# EAGLE design PIC Board (EAGLE 5.12)
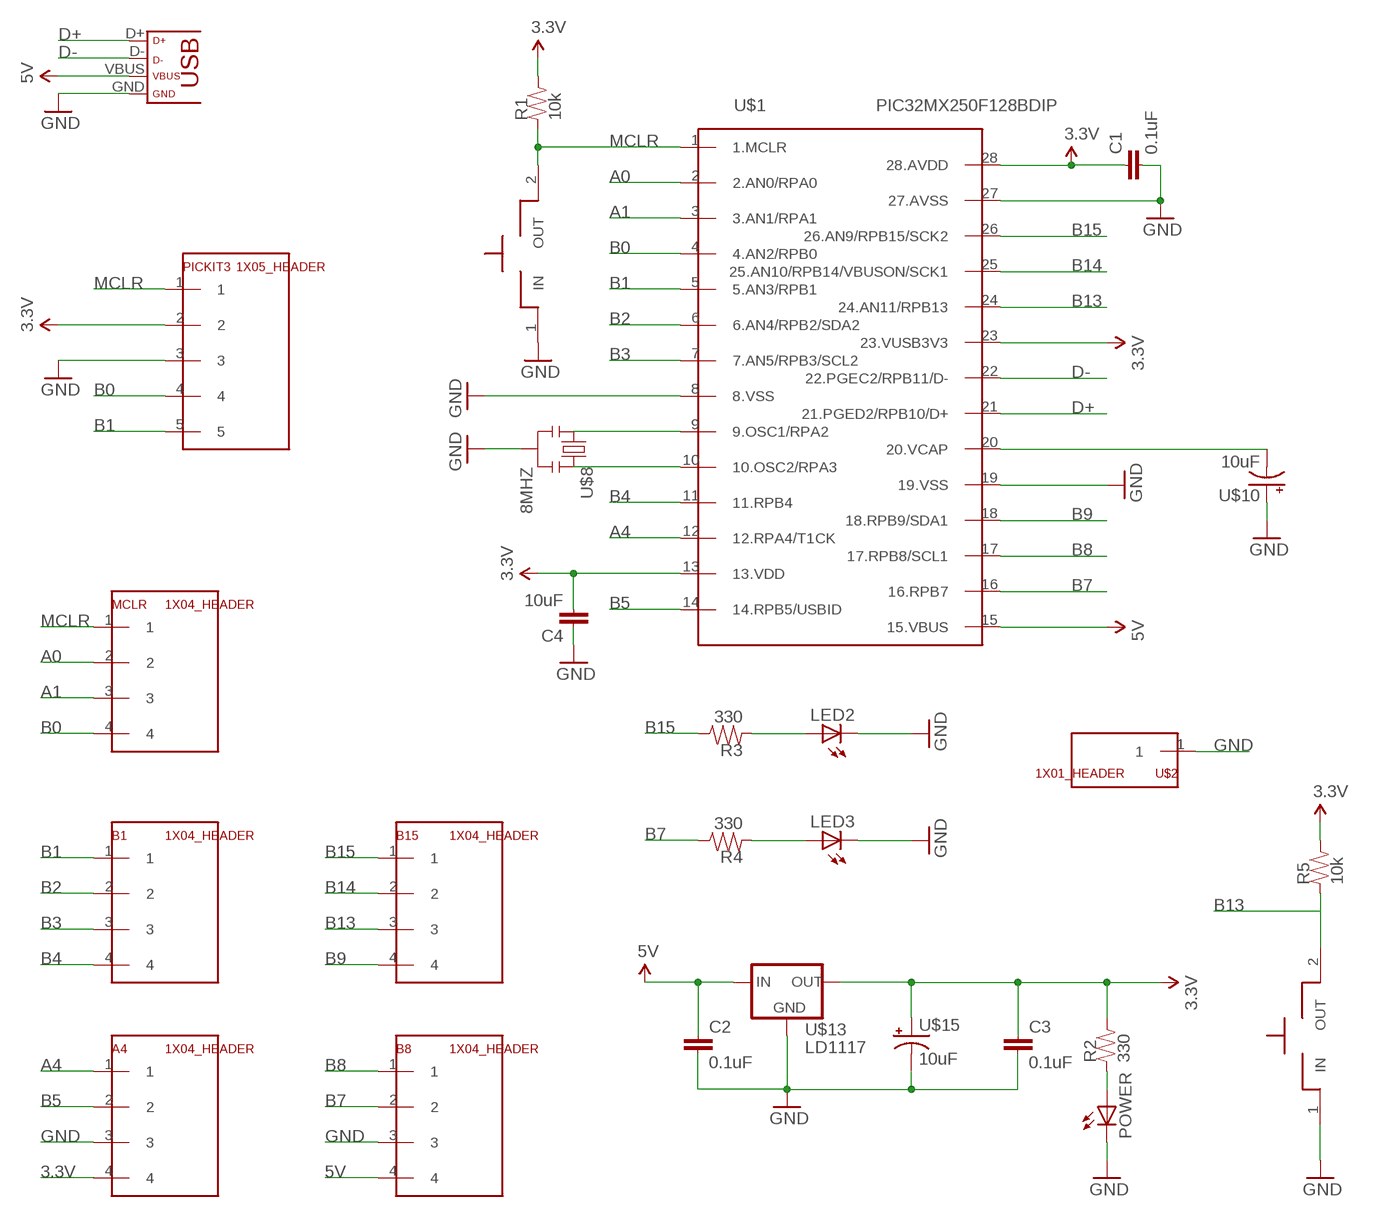
[diagram p0: schematic, sheet 1]

## Parts
A4  1X04_HEADER  [1X04]
B1  1X04_HEADER  [1X04]
B8  1X04_HEADER  [1X04]
B15  1X04_HEADER  [1X04]
C1  0.1uF  CAPPTH  [CAP-PTH-SMALL]
C2  0.1uF  CAPPTH  [CAP-PTH-SMALL]
C3  0.1uF  CAPPTH  [CAP-PTH-SMALL]
C4  10uF  CAPPTH  [CAP-PTH-SMALL]
LED2  LED3MM  [LED3MM]
LED3  LED3MM  [LED3MM]
MCLR  1X04_HEADER  [1X04]
PICKIT3  1X05_HEADER  [1X05]
POWER  LED3MM  [LED3MM]
R1  10k  RRESISTOR(1/4W)  [0207/10]
R2  330  RRESISTOR(1/4W)  [0207/10]
R3  330  RRESISTOR(1/4W)  [0207/10]
R4  330  RRESISTOR(1/4W)  [0207/10]
R5  10k  RRESISTOR(1/4W)  [0207/10]
RESET  BUTTON  [TACTILE_SWITCH]
U$1  PIC32MX250F128BDIP  [DIL28-3]
U$2  1X01_HEADER  [1X01]
U$8  8MHZ  [RESONATOR-PTH]
U$10  10uF  CAP_POL  [CAP_POL_D]
U$11  USB  [USB-MINIB]
U$13  LD1117  [TO220]
U$15  10uF  CAP_POL  [CAP_POL_D]
USER  BUTTON  [TACTILE_SWITCH]

## Nets
3.3V: A4.4 C1.1 C3.1 C4.2 PICKIT3.2 R1.2 R2.2 R5.2 U$1.13(13.VDD) U$1.23(23.VUSB3V3) U$1.28(28.AVDD) U$13.2(OUT) U$15.1(+)
5V: B8.4 C2.1 U$1.15(15.VBUS) U$11.VBUS U$13.3(IN)
A0: MCLR.2 U$1.2(2.AN0/RPA0)
A1: MCLR.3 U$1.3(3.AN1/RPA1)
A4: A4.1 U$1.12(12.RPA4/T1CK)
B0: MCLR.4 PICKIT3.4 U$1.4(4.AN2/RPB0)
B1: B1.1 PICKIT3.5 U$1.5(5.AN3/RPB1)
B2: B1.2 U$1.6(6.AN4/RPB2/SDA2)
B3: B1.3 U$1.7(7.AN5/RPB3/SCL2)
B4: B1.4 U$1.11(11.RPB4)
B5: A4.2 U$1.14(14.RPB5/USBID)
B7: B8.2 R4.2 U$1.16(16.RPB7)
B8: B8.1 U$1.17(17.RPB8/SCL1)
B9: B15.4 U$1.18(18.RPB9/SDA1)
B13: B15.3 R5.1 U$1.24(24.AN11/RPB13) USER.2(OUT)
B14: B15.2 U$1.25(25.AN10/RPB14/VBUSON/SCK1)
B15: B15.1 R3.2 U$1.26(26.AN9/RPB15/SCK2)
D+: U$1.21(21.PGED2/RPB10/D+) U$11.D+
D-: U$1.22(22.PGEC2/RPB11/D-) U$11.D-
GND: A4.3 B8.3 C1.2 C2.2 C3.2 C4.1 LED2.K(C) LED3.K(C) PICKIT3.3 POWER.K(C) RESET.1(IN) U$1.8(8.VSS) U$1.19(19.VSS) U$1.27(27.AVSS) U$2.1 U$8.2 U$10.1(+) U$11.GND U$13.1(GND) U$15.2(-) USER.1(IN)
MCLR: MCLR.1 PICKIT3.1 R1.1 RESET.2(OUT) U$1.1(1.MCLR)
N$1: LED2.A R3.1
N$2: LED3.A R4.1
N$3: POWER.A R2.1
N$23: U$1.20(20.VCAP) U$10.2(-)
OSC1: U$1.9(9.OSC1/RPA2) U$8.1
OSC2: U$1.10(10.OSC2/RPA3) U$8.3

## Library data of the parts
A4 B1 B8 B15 MCLR = ME433:1X04_HEADER
C1-C4 = ME433:CAP: Capacitor Standard 0603 ceramic capacitor, and 0.1" leaded capacitor.
LED2 LED3 POWER = ME433:LED: LEDs Standard schematic elements and footprints for 5mm, 3mm, 1206, and 0603 sized LEDs. 5mm - Spark Fun Electronics SKU : COM-00529 (and others)
PICKIT3 = ME433:1X05_HEADER
R1-R5 = ME433:R: RESISTOR, American symbol
RESET USER = ME433:BUTTON
U$1 = ME433:PIC32MX250F128B
U$2 = ME433:1X01_HEADER
U$8 = ME433:8MHZ
U$10 U$15 = ME433:CAP_POL
U$11 = ME433:USB
U$13 = ME433:LD1117

## Board
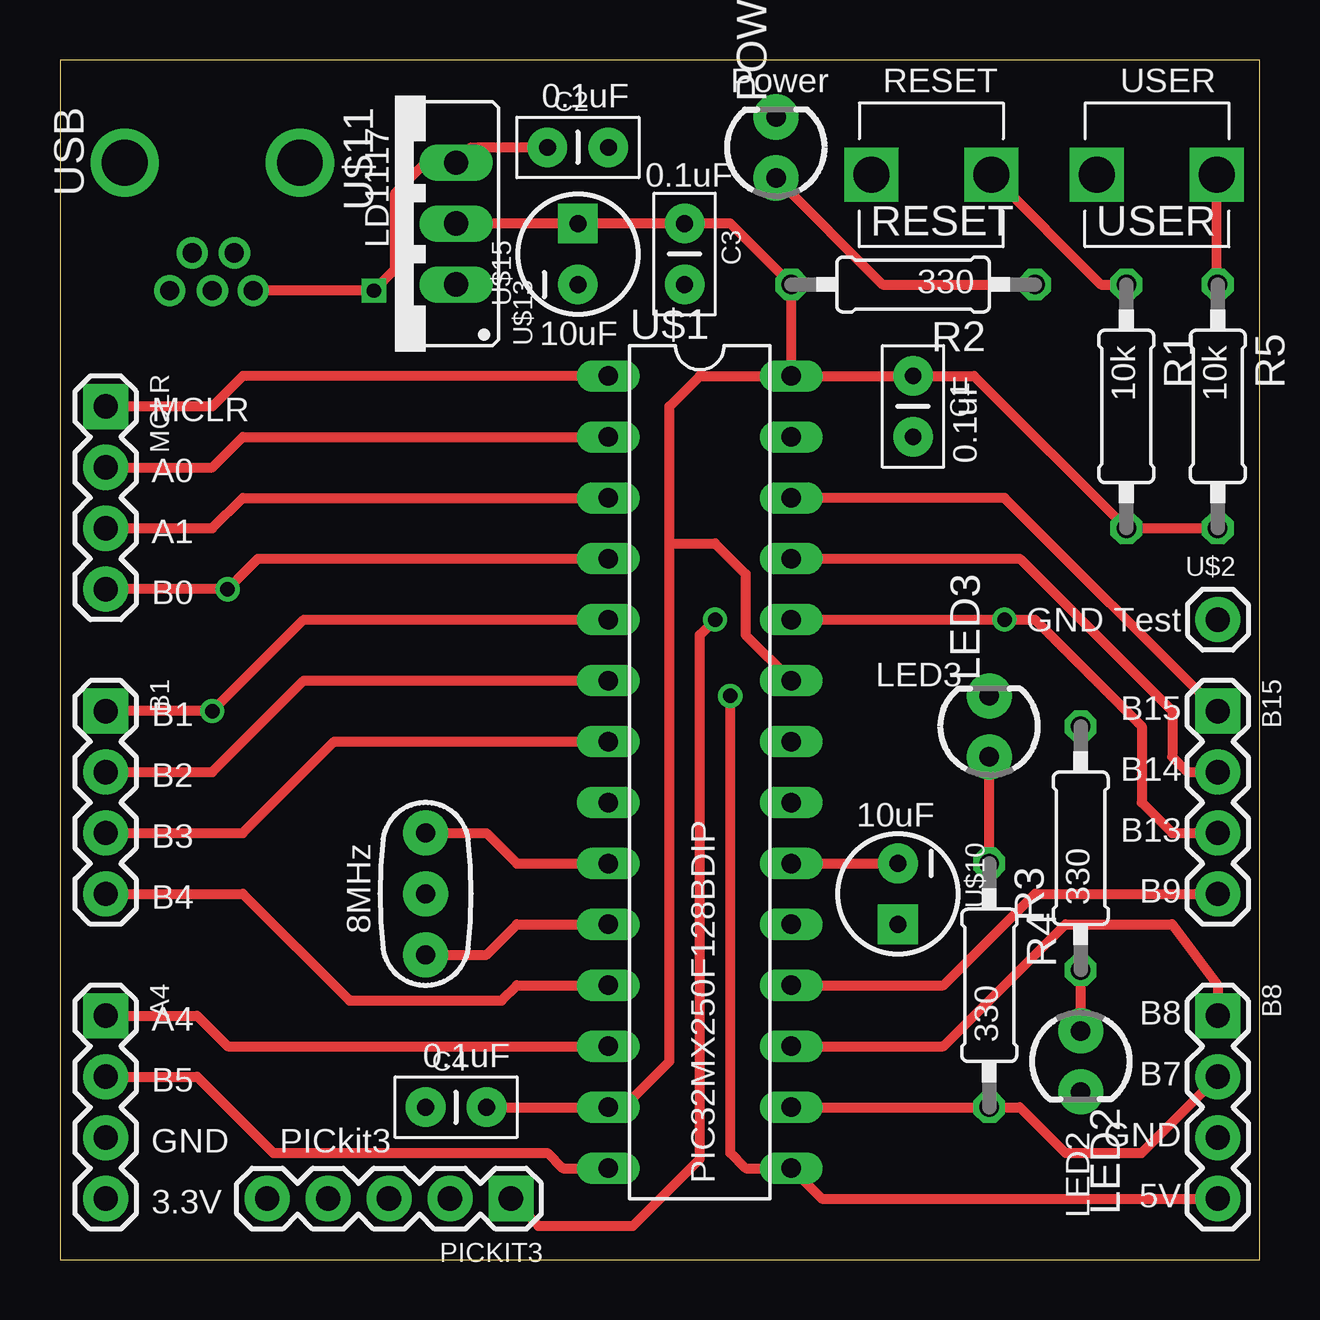
[diagram p1: board, top side]
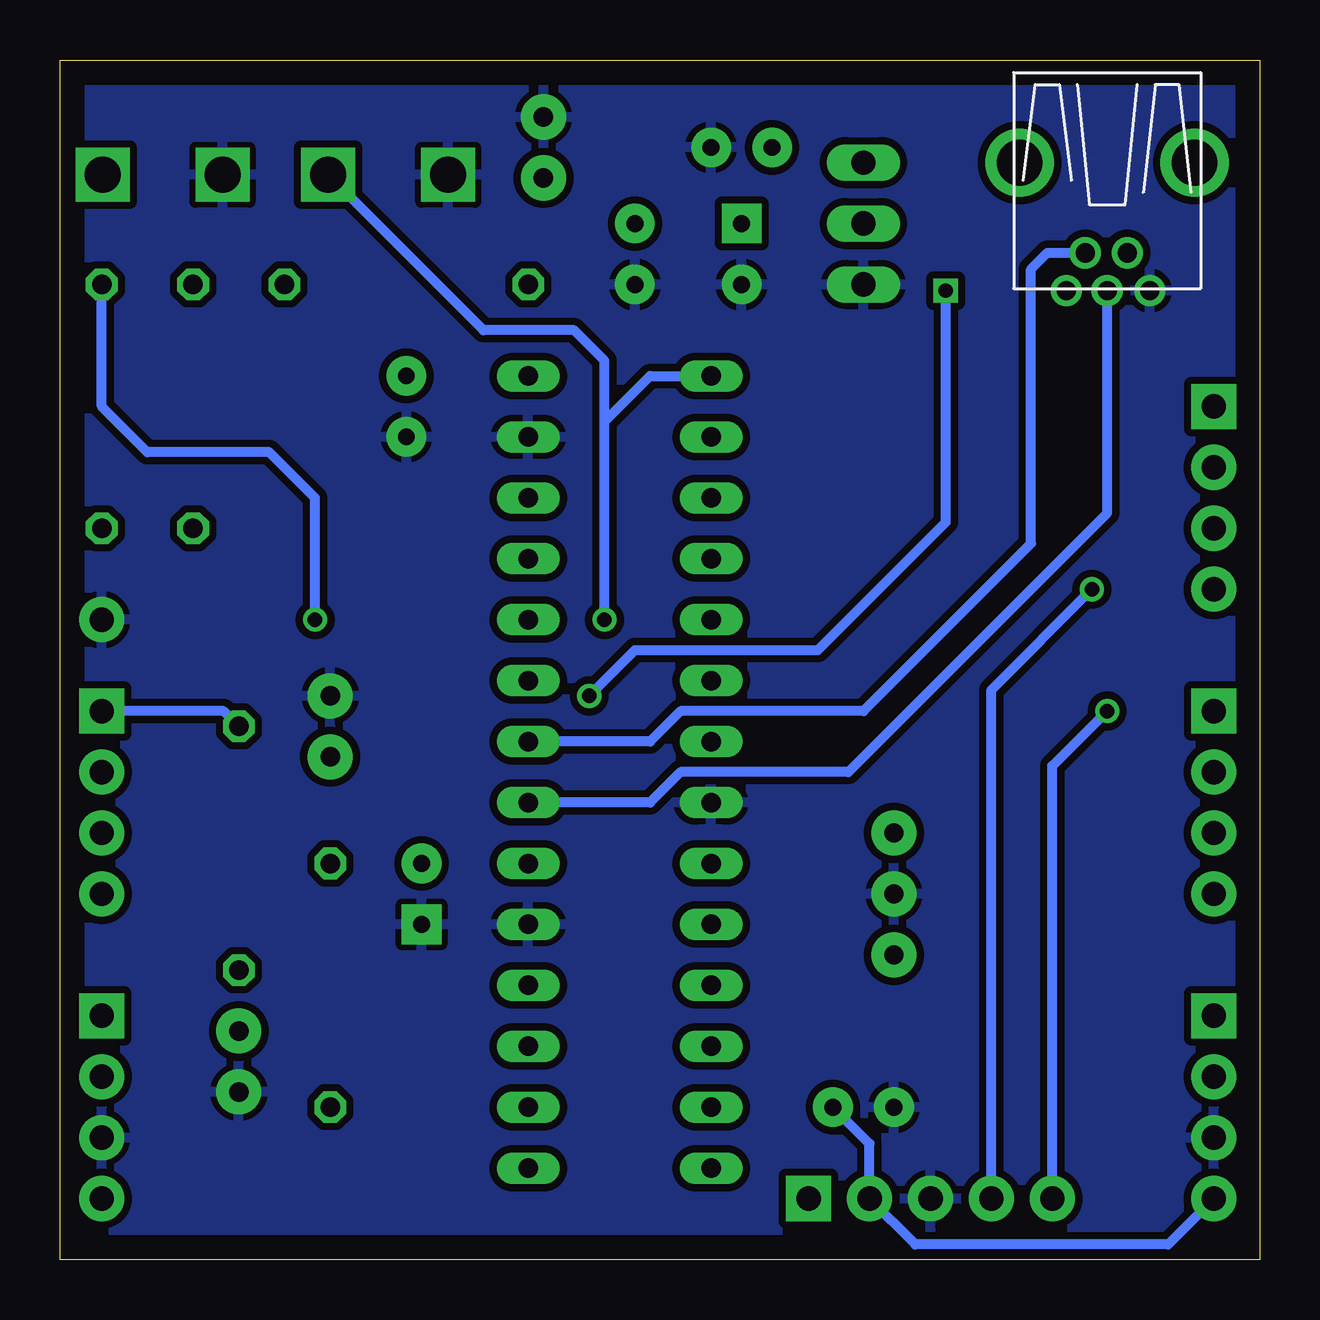
[diagram p2: board, bottom side, seen from below]

Size 50 x 50 mm. Coordinates in mm from the lower left corner, seen from the top.
Outline: 0,0 50,0 50,50 0,50 0,0
Copper layers (1*16): Top 0.035mm / dielectric 1.5mm / Bottom 0.035mm
Design rules "default": minimum track width 10mil, minimum drill 24mil, track to track 8mil, track to pad 8mil, pad to pad 8mil, via to via 8mil, smd to smd 8mil, copper to edge 40mil, drill to drill 8mil, minimum pad ring 10mil, minimum via ring 8mil, stop-mask expansion 4mil, vias tented up to drill 0mil, thermal gap 10mil

### Footprints (pad centres in the part's own frame; a part is rotated, then mirrored left to right if it is on the bottom)
1X04 = drill 1.016 pad 1.88 square: 1 0,0 | drill 1.016 pad 1.88 round: 2 2.54,0; 3 5.08,0; 4 7.62,0
CAP-PTH-SMALL = drill 0.7 pad 1.651 round: 1 0,0; 2 2.54,0
LED3MM = drill 0.813 pad 1.88 round: A -1.27,0; K 1.27,0
1X05 = drill 1.016 pad 1.88 square: 1 0,0 | drill 1.016 pad 1.88 round: 2 2.54,0; 3 5.08,0; 4 7.62,0; 5 10.16,0
0207/10 = drill 0.813 octagon: 1 -5.08,0; 2 5.08,0
TACTILE_SWITCH = drill 1.5 square: 1 -2.5,0; 2 2.5,0
DIL28-3 = drill 0.813 long: 1 -16.51,-3.81; 2 -13.97,-3.81; 3 -11.43,-3.81; 4 -8.89,-3.81; 5 -6.35,-3.81; 6 -3.81,-3.81; 7 -1.27,-3.81; 8 1.27,-3.81; 9 3.81,-3.81; 10 6.35,-3.81; 11 8.89,-3.81; 12 11.43,-3.81; 13 13.97,-3.81; 14 16.51,-3.81; 15 16.51,3.81; 16 13.97,3.81; 17 11.43,3.81; 18 8.89,3.81; 19 6.35,3.81; 20 3.81,3.81; 21 1.27,3.81; 22 -1.27,3.81; 23 -3.81,3.81; 24 -6.35,3.81; 25 -8.89,3.81; 26 -11.43,3.81; 27 -13.97,3.81; 28 -16.51,3.81
1X01 = drill 1.016 pad 1.88 round: 1 0,0
RESONATOR-PTH = drill 0.8 pad 1.88 round: 1 -2.54,0; 2 0,0; 3 2.54,0
CAP_POL_D = drill 0.7 pad 1.651 square: 1 1.27,0 | drill 0.7 pad 1.651 round: 2 -1.27,0
USB-MINIB = drill 0.8 round: D+ 4.064,0; D- 2.489,0.914; GND 4.064,-1.778; ID 2.489,-0.838; VBUS 4.064,1.702 | drill 1.9 round: P$6 -1.27,-3.65; P$7 -1.27,3.65
TO220 = drill 1.016 long: 1 -2.54,0; 2 0,0; 3 2.54,0

### Placement (x,y rotation side)
A4  1.91,10.16 270 top
B1  1.91,22.86 270 top
B8  48.26,10.16 270 top
B15  48.26,22.86 270 top
C1  35.56,36.83 270 top
C2  20.32,46.35 0 top
C3  26.04,43.18 270 top
C4  15.24,6.35 0 top
LED2  42.55,8.26 270 top
LED3  38.73,22.23 90 top
MCLR  1.91,35.56 270 top
PICKIT3  18.8,2.54 180 top
POWER  29.84,46.35 90 top
R1  44.45,35.56 270 top
R2  35.56,40.64 180 top
R3  42.55,17.14 90 top
R4  38.73,11.43 270 top
R5  48.26,35.56 270 top
RESET  36.32,45.21 0 top
U$1  26.67,20.32 270 top
U$2  48.26,26.67 0 top
U$8  15.24,15.24 270 top
U$10  34.92,15.24 270 top
U$11  6.35,44.45 270 top
U$13  16.51,43.18 90 top
U$15  21.59,41.91 90 top
USER  45.72,45.21 0 top

### Tracks (layer width: path | path; a pad name or v marks a point on that pad's centre or on a via)
3.3V
  Top 0.406: C4.2 U$1.13 23.5,6.35 25.4,8.26 25.4,29.84 | U$13.2 U$15.1 C3.1 27.94,43.18 R2.2 U$1.28 | U$1.28 C1.1 38.1,36.83 R1.2 R5.2 | 25.4,29.84 25.4,35.56 26.67,36.83 U$1.28 | U$1.23 28.57,26.04 28.57,28.57 27.3,29.84 25.4,29.84
  Bottom 0.406: A4.4 3.81,0.64 14.35,0.64 PICKIT3.2 16.26,4.83 C4.2
5V  (via drill 0.6)
  Top 0.406: C2.1 17.14,46.35 U$13.3 15.24,45.72 13.97,44.45 13.97,41.27 v13.08,40.39 U$11.VBUS | B8.4 31.75,2.54 U$1.15 28.57,3.81 27.94,4.45 v27.94,23.5
  Bottom 0.406: v13.08,40.39 13.08,30.73 18.41,25.4 26.04,25.4 v27.94,23.5
A0
  Top 0.406: U$1.2 7.62,34.29 6.35,33.02 MCLR.2
A1
  Top 0.406: U$1.3 7.62,31.75 6.35,30.48 MCLR.3
A4
  Top 0.406: U$1.12 6.99,8.89 5.71,10.16 A4.1
B0  (via drill 0.6)
  Top 0.406: U$1.4 8.26,29.21 v6.99,27.94 MCLR.4
  Bottom 0.406: PICKIT3.4 11.18,23.75 v6.99,27.94
B1  (via drill 0.6)
  Top 0.406: U$1.5 10.16,26.67 v6.35,22.86 B1.1
  Bottom 0.406: PICKIT3.5 8.64,20.57 v6.35,22.86
B2
  Top 0.406: U$1.6 10.16,24.13 6.35,20.32 B1.2
B3
  Top 0.406: U$1.7 11.43,21.59 7.62,17.78 B1.3
B4
  Top 0.406: U$1.11 19.05,11.43 18.41,10.79 12.06,10.79 7.62,15.24 B1.4
B5
  Top 0.406: U$1.14 20.95,3.81 20.32,4.45 8.89,4.45 5.71,7.62 A4.2
B7
  Top 0.406: U$1.16 R4.2 40.01,6.35 41.91,4.45 45.09,4.45 B8.2
B8
  Top 0.406: B8.1 48.26,11.43 46.35,13.97 41.91,13.97 36.83,8.89 U$1.17
B9
  Top 0.406: B15.4 40.64,15.24 36.83,11.43 U$1.18
B13  (via drill 0.6)
  Top 0.406: USER.2 48.22,40.68 R5.1 | U$1.24 v39.37,26.67 40.64,26.67 45.09,22.23 45.09,19.05 46.35,17.78 B15.3
  Bottom 0.406: R5.1 48.26,35.56 46.35,33.66 41.27,33.66 39.37,31.75 v39.37,26.67
B14
  Top 0.406: B15.2 46.99,20.32 46.35,20.95 46.35,22.86 40.01,29.21 U$1.25
B15
  Top 0.406: U$1.26 39.37,31.75 B15.1
  Bottom 0.406: B15.1 43.18,22.86 R3.2
D+
  Bottom 0.406: U$11.D+ 6.35,31.11 17.14,20.32 24.13,20.32 25.4,19.05 U$1.21
D-
  Bottom 0.406: U$11.D- 8.84,41.96 9.53,41.27 9.53,29.84 16.51,22.86 24.13,22.86 25.4,21.59 U$1.22
GND
  pour Bottom (isolate 0.305): 0.51,49.53 49.53,49.53 49.53,0.64 0.51,0.64
MCLR  (via drill 0.6)
  Top 0.406: U$1.1 7.62,36.83 6.35,35.56 MCLR.1 | PICKIT3.1 19.94,1.4 23.88,1.4 26.67,4.19 26.67,26.04 v27.3,26.67 | R1.1 43.39,40.64 RESET.2
  Bottom 0.406: v27.3,26.67 27.3,34.92 | 27.3,34.92 25.4,36.83 U$1.1 | 27.3,34.92 27.3,37.47 28.57,38.73 32.34,38.73 RESET.2
N$1
  Top 0.406: LED2.A R3.1
N$2
  Top 0.406: R4.1 LED3.A
N$3
  Top 0.406: R2.1 34.29,40.64 POWER.A
N$23
  Top 0.406: U$1.20 U$10.2
OSC1
  Top 0.406: U$8.1 17.78,17.78 19.05,16.51 U$1.9
OSC2
  Top 0.406: U$1.10 19.05,13.97 17.78,12.7 U$8.3

### Text on the board
tPlace: Power | RESET | USER | 0.1uF | 0.1uF | LD1117 | 330 | 10uF | 10k | 10k | 0.1uF | MCLR | A0 | A1 | B0 | GND Test | LED3 | B15 | B1 | B14 | B2 | 10uF | B13 | B3 | 330 | B9 | B4 | 8MHz | 330 | B8 | A4 | 0.1uF | B7 | B5 | GND | LED2 | GND | PICkit3 | PIC32MX250F128BDIP | 5V | 3.3V